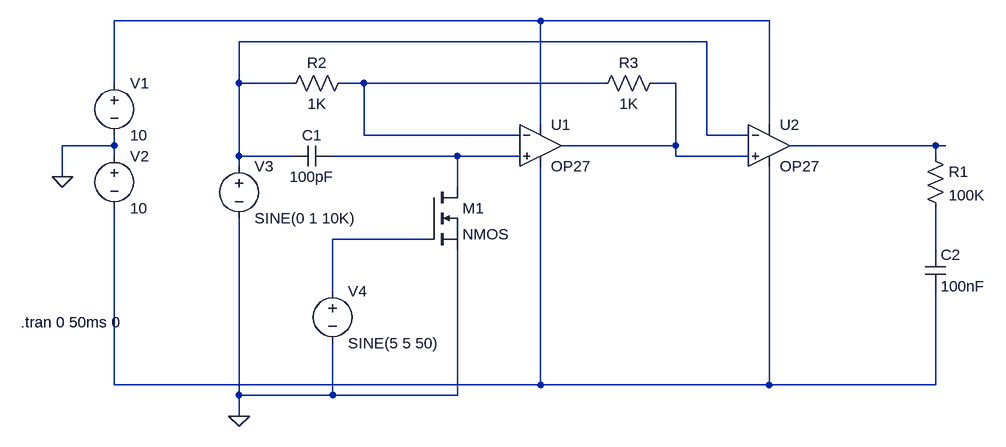
[diagram p0: schematic fet_shift_detect.asc]
fet_shift_detect.asc, the LTspice schematic file:
Version 4
SHEET 1 1304 680
WIRE 592 -80 -64 -80
WIRE 944 -80 592 -80
WIRE 848 -48 128 -48
WIRE -64 16 -64 -80
WIRE 128 16 128 -48
WIRE 208 16 128 16
WIRE 320 16 288 16
WIRE 688 16 320 16
WIRE 800 16 768 16
WIRE 592 80 592 -80
WIRE 944 80 944 -80
WIRE 320 96 320 16
WIRE 560 96 320 96
WIRE 848 96 848 -48
WIRE 912 96 848 96
WIRE -64 112 -64 96
WIRE -64 112 -144 112
WIRE 800 112 800 16
WIRE 800 112 624 112
WIRE 1200 112 976 112
WIRE 1216 112 1200 112
WIRE -64 128 -64 112
WIRE 128 128 128 16
WIRE 208 128 128 128
WIRE 464 128 272 128
WIRE 560 128 464 128
WIRE 800 128 800 112
WIRE 912 128 800 128
WIRE 1200 128 1200 112
WIRE 128 144 128 128
WIRE -144 160 -144 112
WIRE 464 176 464 128
WIRE 416 256 272 256
WIRE 1200 272 1200 208
WIRE 272 336 272 256
WIRE -64 480 -64 208
WIRE 592 480 592 144
WIRE 592 480 -64 480
WIRE 944 480 944 144
WIRE 944 480 592 480
WIRE 1200 480 1200 336
WIRE 1200 480 944 480
WIRE 128 496 128 224
WIRE 272 496 272 416
WIRE 272 496 128 496
WIRE 464 496 464 272
WIRE 464 496 272 496
WIRE 128 528 128 496
FLAG -144 160 0
FLAG 128 528 0
SYMBOL voltage -64 0 R0
WINDOW 123 0 0 Left 2
WINDOW 39 0 0 Left 2
SYMATTR InstName V1
SYMATTR Value 10
SYMBOL voltage -64 112 R0
WINDOW 123 0 0 Left 2
WINDOW 39 0 0 Left 2
SYMATTR InstName V2
SYMATTR Value 10
SYMBOL cap 272 112 R90
WINDOW 0 0 32 VBottom 2
WINDOW 3 32 32 VTop 2
SYMATTR InstName C1
SYMATTR Value 100pF
SYMBOL res 304 0 R90
WINDOW 0 0 56 VBottom 2
WINDOW 3 32 56 VTop 2
SYMATTR InstName R2
SYMATTR Value 1K
SYMBOL res 784 0 R90
WINDOW 0 0 56 VBottom 2
WINDOW 3 32 56 VTop 2
SYMATTR InstName R3
SYMATTR Value 1K
SYMBOL voltage 128 128 R0
WINDOW 123 0 0 Left 2
WINDOW 39 0 0 Left 2
SYMATTR InstName V3
SYMATTR Value SINE(0 1 10K)
SYMBOL nmos 416 176 R0
SYMATTR InstName M1
SYMBOL voltage 272 320 R0
WINDOW 123 0 0 Left 2
WINDOW 39 0 0 Left 2
SYMATTR InstName V4
SYMATTR Value SINE(5 5 50)
SYMBOL res 1184 112 R0
SYMATTR InstName R1
SYMATTR Value 100K
SYMBOL cap 1184 272 R0
SYMATTR InstName C2
SYMATTR Value 100nF
SYMBOL Opamps\\OP27 944 48 R0
SYMATTR InstName U2
SYMBOL Opamps\\OP27 592 48 R0
SYMATTR InstName U1
TEXT -208 384 Left 2 !.tran 0 50ms 0

The netlist it stands for:
* fet_shift_detect.asc
V1 N001 0 10
V2 0 N009 10
C1 N006 N002 100pF
R2 N003 N002 1K
R3 N004 N003 1K
V3 N002 0 SINE(0 1 10K)
M1 N006 N007 0 0 NMOS
V4 N007 0 SINE(5 5 50)
R1 N005 N008 100K
C2 N008 N009 100nF
XU2 N004 N002 N001 N009 N005 OP27  ; pins In+ In- V+ V- OUT
XU1 N006 N003 N001 N009 N004 OP27  ; pins In+ In- V+ V- OUT
.model NMOS NMOS
.model PMOS PMOS
.lib standard.mos
.tran 0 50ms 0
.lib ADI.lib
.backanno
.end